# Altium schematic sheet [03]CORE_BOARD.SchDoc
size B
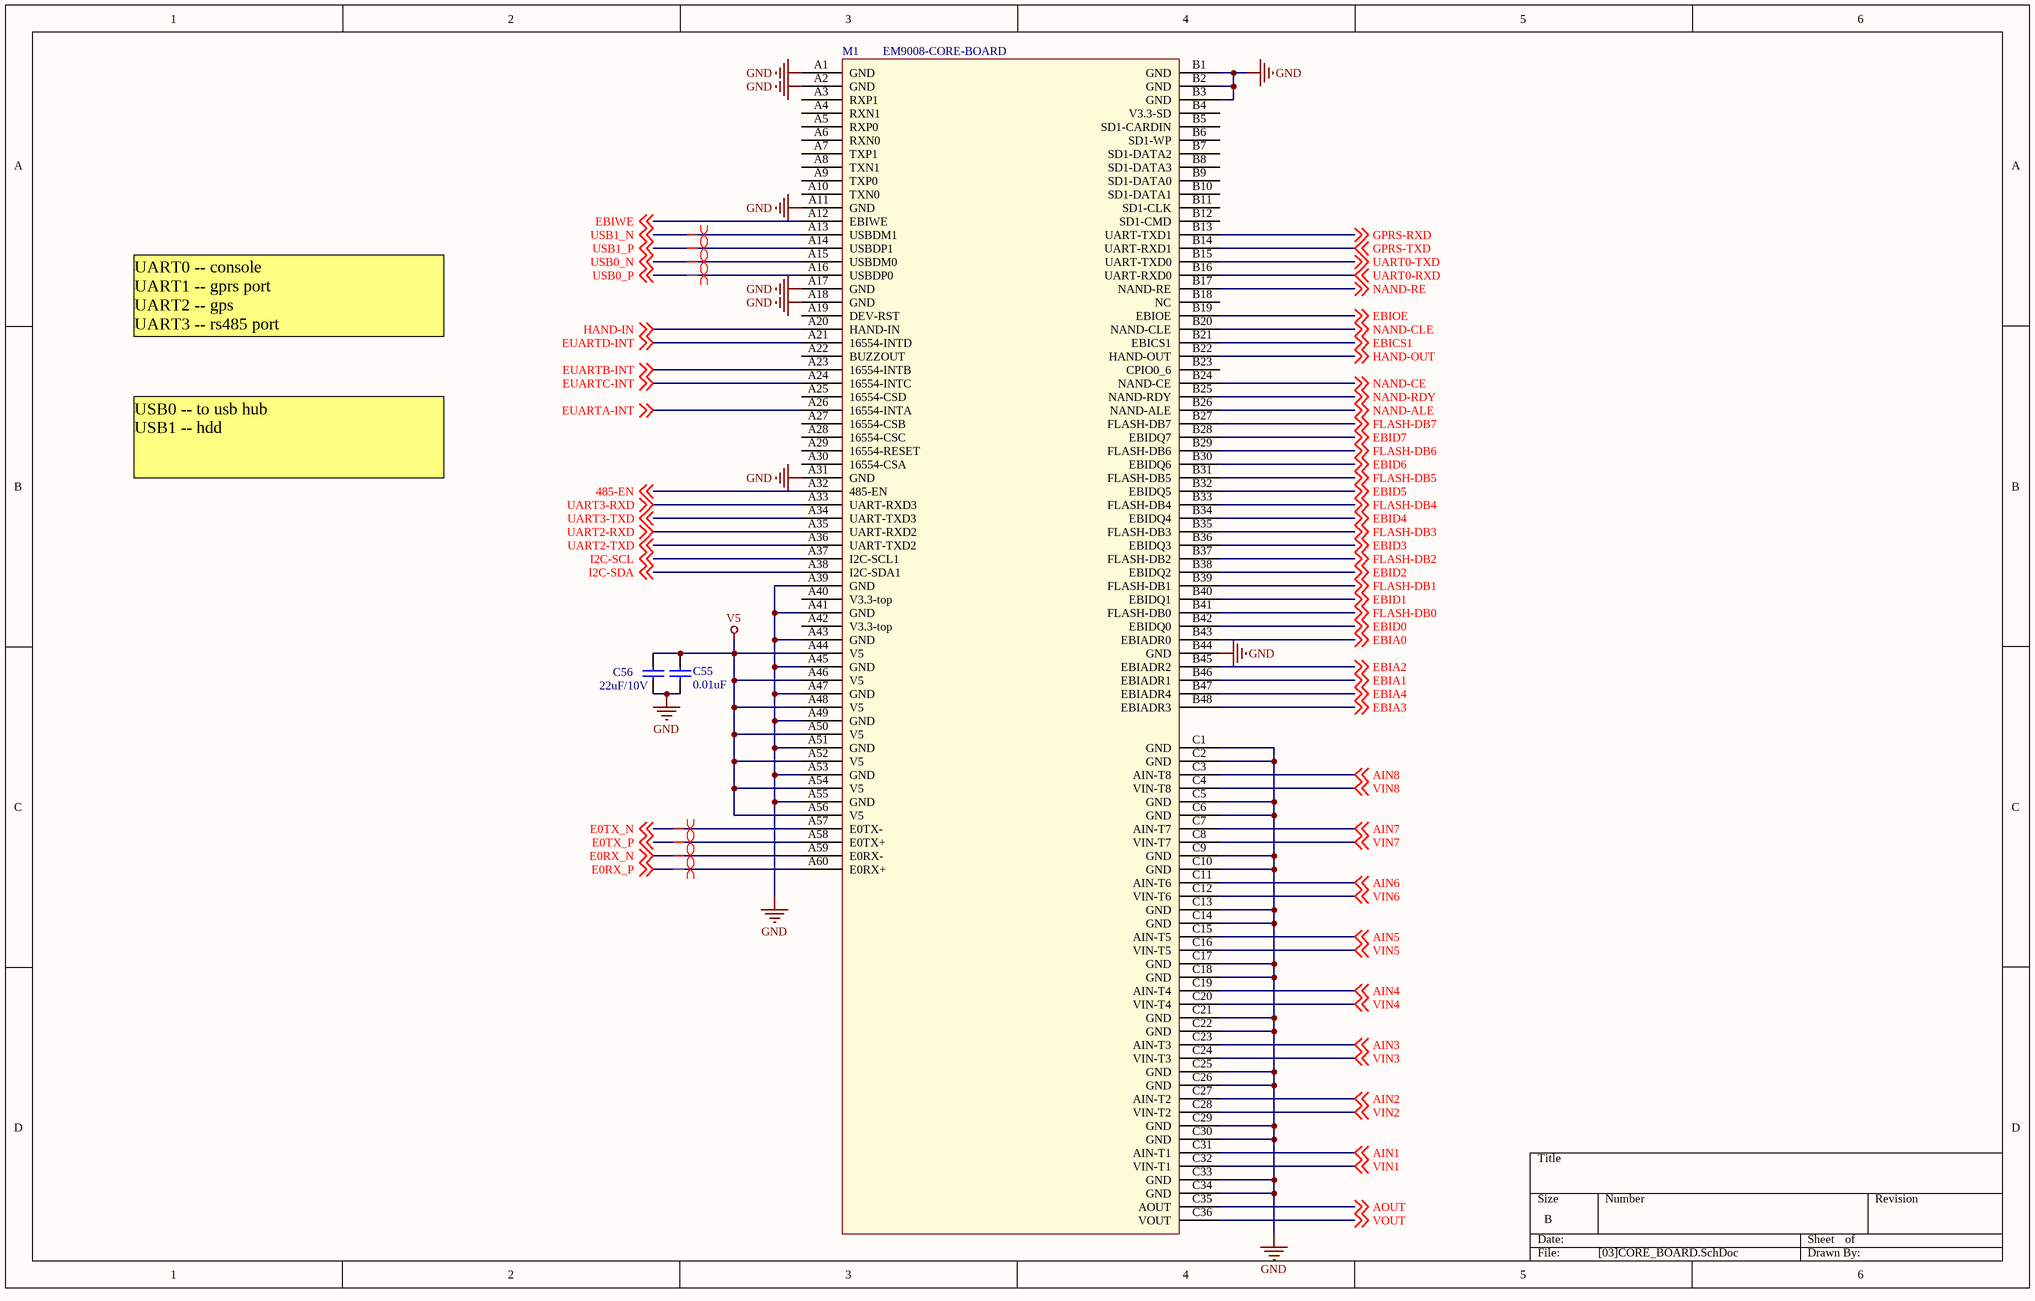
[diagram p0: [03]CORE_BOARD.SchDoc]

## Parts
C55  0.01uF  [0603]
C56  22uF/10V  [1210]
M1  EM9008-CORE-BOARD  [EM9008]

## Nets
GND: C55.1 C56.1 M1.A1(GND) M1.A2(GND) M1.A11(GND) M1.A17(GND) M1.A18(GND) M1.A31(GND) M1.A39(GND) M1.A41(GND) M1.A43(GND) M1.A45(GND) M1.A47(GND) M1.A49(GND) M1.A51(GND) M1.A53(GND) M1.A55(GND) M1.B1(GND) M1.B2(GND) M1.B3(GND) M1.B44(GND) M1.C1(GND) M1.C2(GND) M1.C5(GND) M1.C6(GND) M1.C9(GND) M1.C10(GND) M1.C13(GND) M1.C14(GND) M1.C17(GND) M1.C18(GND) M1.C21(GND) M1.C22(GND) M1.C25(GND) M1.C26(GND) M1.C29(GND) M1.C30(GND) M1.C33(GND) M1.C34(GND)
V5: C55.2 C56.2 M1.A44(V5) M1.A46(V5) M1.A48(V5) M1.A50(V5) M1.A52(V5) M1.A54(V5) M1.A56(V5)
485-EN: M1.A32(485-EN) ; off-sheet 485-EN
AIN1: M1.C31(AIN-T1) ; off-sheet AIN1
AIN2: M1.C27(AIN-T2) ; off-sheet AIN2
AIN3: M1.C23(AIN-T3) ; off-sheet AIN3
AIN4: M1.C19(AIN-T4) ; off-sheet AIN4
AIN5: M1.C15(AIN-T5) ; off-sheet AIN5
AIN6: M1.C11(AIN-T6) ; off-sheet AIN6
AIN7: M1.C7(AIN-T7) ; off-sheet AIN7
AIN8: M1.C3(AIN-T8) ; off-sheet AIN8
AOUT: M1.C35(AOUT) ; off-sheet AOUT
E0RX_N: M1.A59(E0RX-) ; off-sheet E0RX_N
E0RX_P: M1.A60(E0RX+) ; off-sheet E0RX_P
E0TX_N: M1.A57(E0TX-) ; off-sheet E0TX_N
E0TX_P: M1.A58(E0TX+) ; off-sheet E0TX_P
EBIA0: M1.B43(EBIADR0) ; off-sheet EBIA0
EBIA1: M1.B46(EBIADR1) ; off-sheet EBIA1
EBIA2: M1.B45(EBIADR2) ; off-sheet EBIA2
EBIA3: M1.B48(EBIADR3) ; off-sheet EBIA3
EBIA4: M1.B47(EBIADR4) ; off-sheet EBIA4
EBICS1: M1.B21(EBICS1) ; off-sheet EBICS1
EBID0: M1.B42(EBIDQ0) ; off-sheet EBID0
EBID1: M1.B40(EBIDQ1) ; off-sheet EBID1
EBID2: M1.B38(EBIDQ2) ; off-sheet EBID2
EBID3: M1.B36(EBIDQ3) ; off-sheet EBID3
EBID4: M1.B34(EBIDQ4) ; off-sheet EBID4
EBID5: M1.B32(EBIDQ5) ; off-sheet EBID5
EBID6: M1.B30(EBIDQ6) ; off-sheet EBID6
EBID7: M1.B28(EBIDQ7) ; off-sheet EBID7
EBIOE: M1.B19(EBIOE) ; off-sheet EBIOE
EBIWE: M1.A12(EBIWE) ; off-sheet EBIWE
EUARTA-INT: M1.A26(16554-INTA) ; off-sheet EUARTA-INT
EUARTB-INT: M1.A23(16554-INTB) ; off-sheet EUARTB-INT
EUARTC-INT: M1.A24(16554-INTC) ; off-sheet EUARTC-INT
EUARTD-INT: M1.A21(16554-INTD) ; off-sheet EUARTD-INT
FLASH-DB0: M1.B41(FLASH-DB0) ; off-sheet FLASH-DB0
FLASH-DB1: M1.B39(FLASH-DB1) ; off-sheet FLASH-DB1
FLASH-DB2: M1.B37(FLASH-DB2) ; off-sheet FLASH-DB2
FLASH-DB3: M1.B35(FLASH-DB3) ; off-sheet FLASH-DB3
FLASH-DB4: M1.B33(FLASH-DB4) ; off-sheet FLASH-DB4
FLASH-DB5: M1.B31(FLASH-DB5) ; off-sheet FLASH-DB5
FLASH-DB6: M1.B29(FLASH-DB6) ; off-sheet FLASH-DB6
FLASH-DB7: M1.B27(FLASH-DB7) ; off-sheet FLASH-DB7
GPRS-RXD: M1.B13(UART-TXD1) ; off-sheet GPRS-RXD
GPRS-TXD: M1.B14(UART-RXD1) ; off-sheet GPRS-TXD
HAND-IN: M1.A20(HAND-IN) ; off-sheet HAND-IN
HAND-OUT: M1.B22(HAND-OUT) ; off-sheet HAND-OUT
I2C-SCL: M1.A37(I2C-SCL1) ; off-sheet I2C-SCL
I2C-SDA: M1.A38(I2C-SDA1) ; off-sheet I2C-SDA
NAND-ALE: M1.B26(NAND-ALE) ; off-sheet NAND-ALE
NAND-CE: M1.B24(NAND-CE) ; off-sheet NAND-CE
NAND-CLE: M1.B20(NAND-CLE) ; off-sheet NAND-CLE
NAND-RDY: M1.B25(NAND-RDY) ; off-sheet NAND-RDY
NAND-RE: M1.B17(NAND-RE) ; off-sheet NAND-RE
UART0-RXD: M1.B16(UART-RXD0) ; off-sheet UART0-RXD
UART0-TXD: M1.B15(UART-TXD0) ; off-sheet UART0-TXD
UART2-RXD: M1.A35(UART-RXD2) ; off-sheet UART2-RXD
UART2-TXD: M1.A36(UART-TXD2) ; off-sheet UART2-TXD
UART3-RXD: M1.A33(UART-RXD3) ; off-sheet UART3-RXD
UART3-TXD: M1.A34(UART-TXD3) ; off-sheet UART3-TXD
USB0_N: M1.A15(USBDM0) ; off-sheet USB0_N
USB0_P: M1.A16(USBDP0) ; off-sheet USB0_P
USB1_N: M1.A13(USBDM1) ; off-sheet USB1_N
USB1_P: M1.A14(USBDP1) ; off-sheet USB1_P
VIN1: M1.C32(VIN-T1) ; off-sheet VIN1
VIN2: M1.C28(VIN-T2) ; off-sheet VIN2
VIN3: M1.C24(VIN-T3) ; off-sheet VIN3
VIN4: M1.C20(VIN-T4) ; off-sheet VIN4
VIN5: M1.C16(VIN-T5) ; off-sheet VIN5
VIN6: M1.C12(VIN-T6) ; off-sheet VIN6
VIN7: M1.C8(VIN-T7) ; off-sheet VIN7
VIN8: M1.C4(VIN-T8) ; off-sheet VIN8
VOUT: M1.C36(VOUT) ; off-sheet VOUT

Not connected (* = marked no-connect by the designer): M1 A3(RXP1) A4(RXN1) A5(RXP0) A6(RXN0) A7(TXP1) A8(TXN1) A9(TXP0) A10(TXN0) A19(DEV-RST) A22(BUZZOUT) A25(16554-CSD) A27(16554-CSB) A28(16554-CSC) A29(16554-RESET) A30(16554-CSA) A40(V3.3-top) A42(V3.3-top) B4(V3.3-SD) B5(SD1-CARDIN) B6(SD1-WP) B7(SD1-DATA2) B8(SD1-DATA3) B9(SD1-DATA0) B10(SD1-DATA1) B11(SD1-CLK) B12(SD1-CMD) B18(NC) B23(CPIO0_6)

## Layout directives
differential pair: E0RX_N, E0RX_P, E0TX_N, E0TX_P, USB0_N, USB0_P, USB1_N, USB1_P

## Notes on the sheet
- UART0 -- console
  UART1 -- gprs port
  UART2 -- gps
  UART3 -- rs485 port
- USB0 -- to usb hub
  USB1 -- hdd

## Library data of the parts
C55 C56 = Cap: Capacitor